# EAGLE design kfly_v3.1 (EAGLE 6.5.0)

## Sheet 1 of 8: MCU
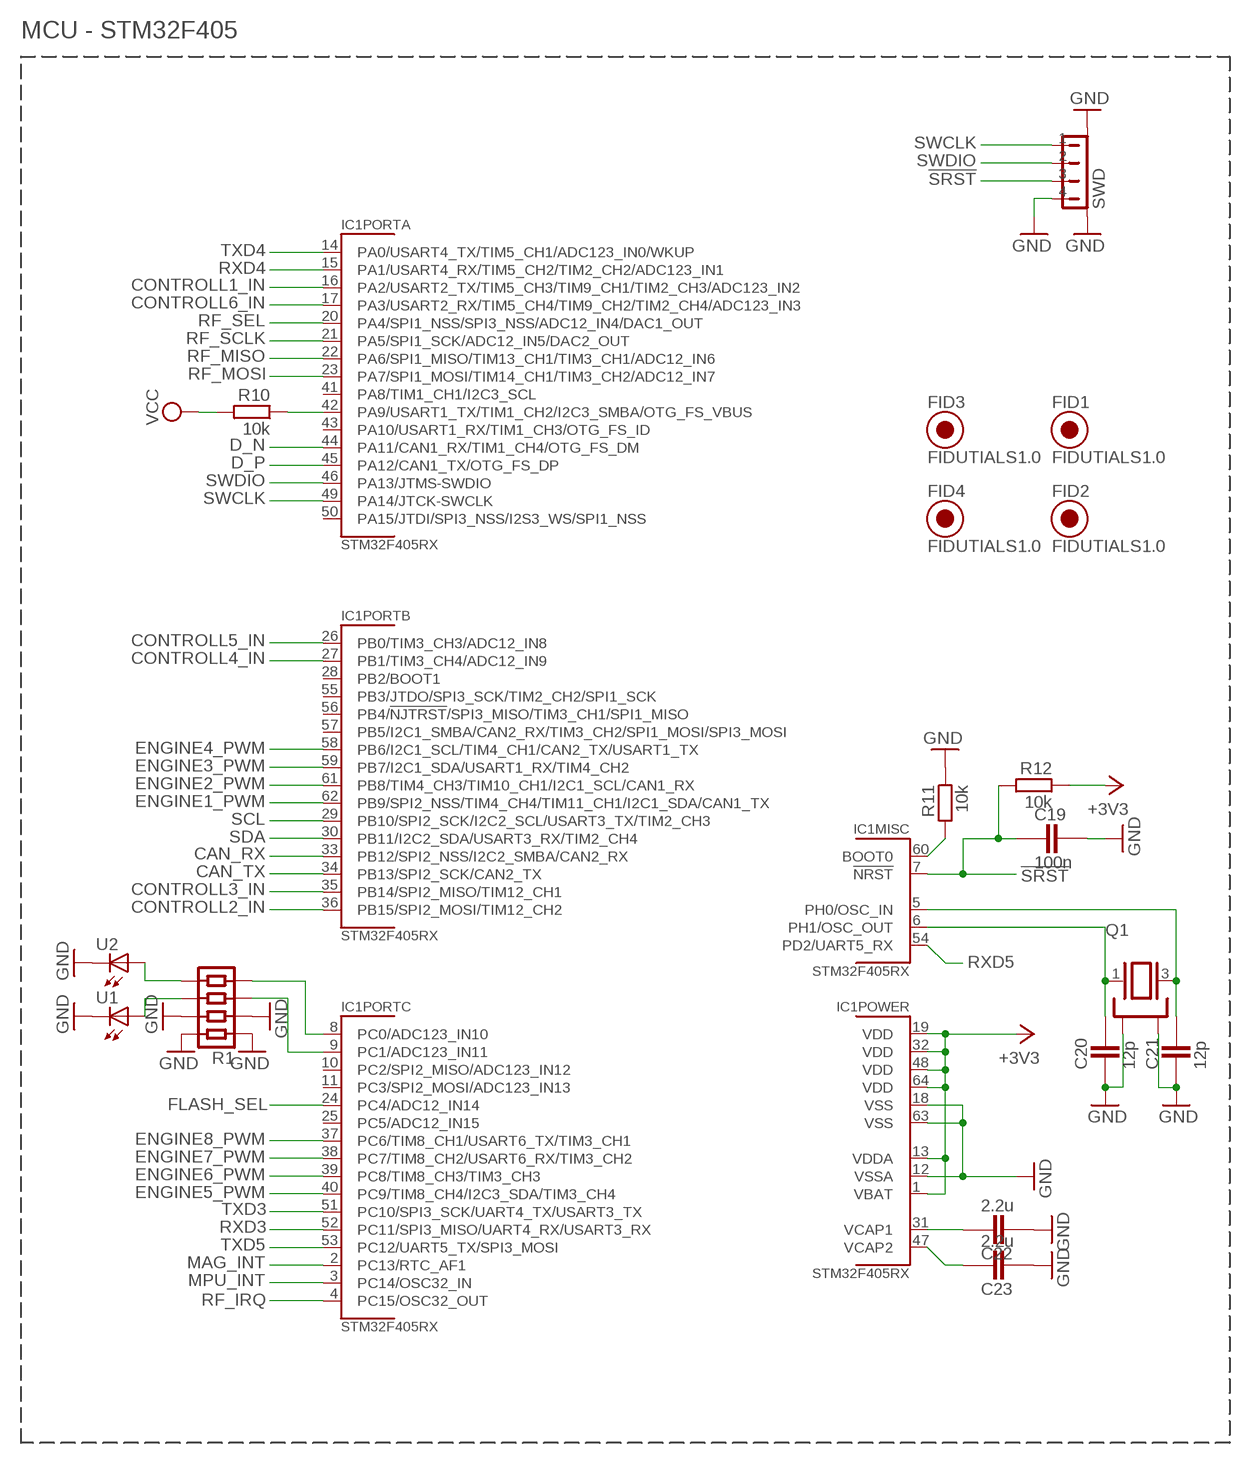
[diagram p0: schematic, sheet 1]

### Parts
C19  100n  CAPACITOR_0402  [CAPC1005X60N]
C20  12p  CAPACITOR_0402  [CAPC1005X60N]
C21  12p  CAPACITOR_0402  [CAPC1005X60N]
C22  2.2u  CAPACITOR_0603  [CAPC1608X92N]
C23  2.2u  CAPACITOR_0603  [CAPC1608X92N]
FID1  FIDUTIALS1.0  [FID1.0]
FID2  FIDUTIALS1.0  [FID1.0]
FID3  FIDUTIALS1.0  [FID1.0]
FID4  FIDUTIALS1.0  [FID1.0]
IC1  STM32F405RX  STM32F4X5RX  [LQFP64-10X10]
Q1  2.5X3.2CRYSTAL  [2.5X3.2CRYSTAL]
R1  RESISTOR-4ARRAY-0804  [RESISTORARRAY_0804]
R10  10k  RESISTOR_0402  [RESC1005X40AN]
R11  10k  RESISTOR_0402  [RESC1005X40AN]
R12  10k  RESISTOR_0402  [RESC1005X40AN]
SWD  JST-4PIN-SIDE-1.0  [JST-4PIN-SIDE]
U1  LED0603  [LED-0603]
U2  LED0603  [LED-0603]

### Nets
!SRST: C19.1 IC1.7(MISC:!NRST!) R12.2 SWD.3
+3V3: IC1.1(POWER:VBAT) IC1.13(POWER:VDDA) IC1.19(POWER:VDD) IC1.32(POWER:VDD) IC1.48(POWER:VDD) IC1.64(POWER:VDD) R12.1 ; also sheet 2,3,4,6,8
CAN_RX: IC1.33(PORTB:PB12/SPI2_NSS/I2C2_SMBA/CAN2_RX) ; also sheet 6
CAN_TX: IC1.34(PORTB:PB13/SPI2_SCK/CAN2_TX) ; also sheet 6
CONTROLL1_IN: IC1.16(PORTA:PA2/USART2_TX/TIM5_CH3/TIM9_CH1/TIM2_CH3/ADC123_IN2) ; also sheet 6
CONTROLL2_IN: IC1.36(PORTB:PB15/SPI2_MOSI/TIM12_CH2) ; also sheet 6
CONTROLL3_IN: IC1.35(PORTB:PB14/SPI2_MISO/TIM12_CH1) ; also sheet 6
CONTROLL4_IN: IC1.27(PORTB:PB1/TIM3_CH4/ADC12_IN9) ; also sheet 6
CONTROLL5_IN: IC1.26(PORTB:PB0/TIM3_CH3/ADC12_IN8) ; also sheet 6
CONTROLL6_IN: IC1.17(PORTA:PA3/USART2_RX/TIM5_CH4/TIM9_CH2/TIM2_CH4/ADC123_IN3) ; also sheet 6
D_N: IC1.44(PORTA:PA11/CAN1_RX/TIM1_CH4/OTG_FS_DM) ; also sheet 5
D_P: IC1.45(PORTA:PA12/CAN1_TX/OTG_FS_DP) ; also sheet 5
ENGINE1_PWM: IC1.62(PORTB:PB9/SPI2_NSS/TIM4_CH4/TIM11_CH1/I2C1_SDA/CAN1_TX) ; also sheet 7
ENGINE2_PWM: IC1.61(PORTB:PB8/TIM4_CH3/TIM10_CH1/I2C1_SCL/CAN1_RX) ; also sheet 7
ENGINE3_PWM: IC1.59(PORTB:PB7/I2C1_SDA/USART1_RX/TIM4_CH2) ; also sheet 7
ENGINE4_PWM: IC1.58(PORTB:PB6/I2C1_SCL/TIM4_CH1/CAN2_TX/USART1_TX) ; also sheet 7
ENGINE5_PWM: IC1.40(PORTC:PC9/TIM8_CH4/I2C3_SDA/TIM3_CH4) ; also sheet 7
ENGINE6_PWM: IC1.39(PORTC:PC8/TIM8_CH3/TIM3_CH3) ; also sheet 7
ENGINE7_PWM: IC1.38(PORTC:PC7/TIM8_CH2/USART6_RX/TIM3_CH2) ; also sheet 7
ENGINE8_PWM: IC1.37(PORTC:PC6/TIM8_CH1/USART6_TX/TIM3_CH1) ; also sheet 7
FLASH_SEL: IC1.24(PORTC:PC4/ADC12_IN14) ; also sheet 3
GND: C19.2 C20.1 C21.1 C22.2 C23.2 IC1.12(POWER:VSSA) IC1.18(POWER:VSS) IC1.63(POWER:VSS) Q1.2 Q1.4 R1.1 R1.2 R1.7 R1.8 R11.1 SWD.4 SWD.NC1(P1) SWD.NC2(P2) U1.C U2.C ; also sheet 2,3,4,5,6,7,8
MAG_INT: IC1.2(PORTC:PC13/RTC_AF1) ; also sheet 4
MPU_INT: IC1.3(PORTC:PC14/OSC32_IN) ; also sheet 4
N$11: R1.5 U2.A
N$18: R1.6 U1.A
N$19: IC1.60(MISC:BOOT0) R11.2
N$20: IC1.8(PORTC:PC0/ADC123_IN10) R1.4
N$24: IC1.9(PORTC:PC1/ADC123_IN11) R1.3
N$25: C20.2 IC1.6(MISC:PH1/OSC_OUT) Q1.1
N$26: C21.2 IC1.5(MISC:PH0/OSC_IN) Q1.3
N$35: IC1.42(PORTA:PA9/USART1_TX/TIM1_CH2/I2C3_SMBA/OTG_FS_VBUS) R10.1
N$44: C22.1 IC1.31(POWER:VCAP1)
N$50: C23.1 IC1.47(POWER:VCAP2)
RF_IRQ: IC1.4(PORTC:PC15/OSC32_OUT) ; also sheet 8
RF_MISO: IC1.22(PORTA:PA6/SPI1_MISO/TIM13_CH1/TIM3_CH1/ADC12_IN6) ; also sheet 3,8
RF_MOSI: IC1.23(PORTA:PA7/SPI1_MOSI/TIM14_CH1/TIM3_CH2/ADC12_IN7) ; also sheet 3,8
RF_SCLK: IC1.21(PORTA:PA5/SPI1_SCK/ADC12_IN5/DAC2_OUT) ; also sheet 3,8
RF_SEL: IC1.20(PORTA:PA4/SPI1_NSS/SPI3_NSS/ADC12_IN4/DAC1_OUT) ; also sheet 8
RXD3: IC1.52(PORTC:PC11/SPI3_MISO/UART4_RX/USART3_RX) ; also sheet 6
RXD4: IC1.15(PORTA:PA1/USART4_RX/TIM5_CH2/TIM2_CH2/ADC123_IN1) ; also sheet 6
RXD5: IC1.54(MISC:PD2/UART5_RX) ; also sheet 6
SCL: IC1.29(PORTB:PB10/SPI2_SCK/I2C2_SCL/USART3_TX/TIM2_CH3) ; also sheet 4
SDA: IC1.30(PORTB:PB11/I2C2_SDA/USART3_RX/TIM2_CH4) ; also sheet 4
SWCLK: IC1.49(PORTA:PA14/JTCK-SWCLK) SWD.1
SWDIO: IC1.46(PORTA:PA13/JTMS-SWDIO) SWD.2
TXD3: IC1.51(PORTC:PC10/SPI3_SCK/UART4_TX/USART3_TX) ; also sheet 6
TXD4: IC1.14(PORTA:PA0/USART4_TX/TIM5_CH1/ADC123_IN0/WKUP) ; also sheet 6
TXD5: IC1.53(PORTC:PC12/UART5_TX/SPI3_MOSI) ; also sheet 6
VCC: R10.2 ; also sheet 2,5
Unconnected: IC1.10(PORTC:PC2/SPI2_MISO/ADC123_IN12) IC1.11(PORTC:PC3/SPI2_MOSI/ADC123_IN13) IC1.25(PORTC:PC5/ADC12_IN15) IC1.28(PORTB:PB2/BOOT1) IC1.41(PORTA:PA8/TIM1_CH1/I2C3_SCL) IC1.43(PORTA:PA10/USART1_RX/TIM1_CH3/OTG_FS_ID) IC1.50(PORTA:PA15/JTDI/SPI3_NSS/I2S3_WS/SPI1_NSS) IC1.55(PORTB:PB3/JTDO/SPI3_SCK/TIM2_CH2/SPI1_SCK) IC1.56(PORTB:PB4/!NJTRST!/SPI3_MISO/TIM3_CH1/SPI1_MISO) IC1.57(PORTB:PB5/I2C1_SMBA/CAN2_RX/TIM3_CH2/SPI1_MOSI/SPI3_MOSI)

### Notes on the sheet
- MCU - STM32F405

## Sheet 2 of 8: Power supply
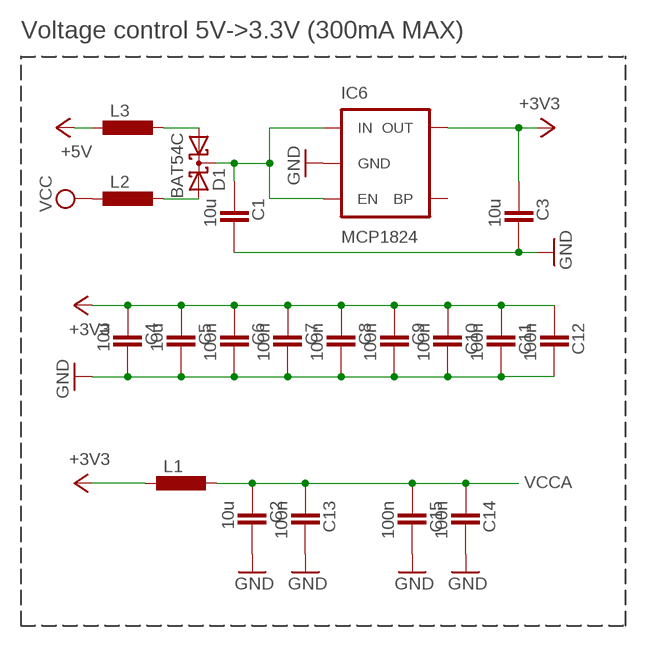
[diagram p1: schematic, sheet 2]

### Parts
C1  10u  CAPACITOR_0603  [CAPC1608X92N]
C2  10u  CAPACITOR_0603  [CAPC1608X92N]
C3  10u  CAPACITOR_0603  [CAPC1608X92N]
C4  10u  CAPACITOR_0603  [CAPC1608X92N]
C5  10u  CAPACITOR_0603  [CAPC1608X92N]
C6  100n  CAPACITOR_0402  [CAPC1005X60N]
C7  100n  CAPACITOR_0402  [CAPC1005X60N]
C8  100n  CAPACITOR_0402  [CAPC1005X60N]
C9  100n  CAPACITOR_0402  [CAPC1005X60N]
C10  100n  CAPACITOR_0402  [CAPC1005X60N]
C11  100n  CAPACITOR_0402  [CAPC1005X60N]
C12  100n  CAPACITOR_0402  [CAPC1005X60N]
C13  100n  CAPACITOR_0402  [CAPC1005X60N]
C14  100n  CAPACITOR_0402  [CAPC1005X60N]
C15  100n  CAPACITOR_0402  [CAPC1005X60N]
D1  BAT54C  [SOT23]
IC6  MCP1824  V_REG_LDOSMD  [SOT23-5]
L1  INDUCTOR_0603  [INDC1608X95N]
L2  INDUCTOR_0603  [INDC1608X95N]
L3  INDUCTOR_0603  [INDC1608X95N]

### Nets
+3V3: C3.1 C4.1 C5.1 C6.1 C7.1 C8.1 C9.1 C10.1 C11.1 C12.1 IC6.5(OUT) L1.1 ; also sheet 1,3,4,6,8
+5V: L3.1 ; also sheet 6,7
GND: C1.2 C2.2 C3.2 C4.2 C5.2 C6.2 C7.2 C8.2 C9.2 C10.2 C11.2 C12.2 C13.2 C14.2 C15.2 IC6.2(GND) ; also sheet 1,3,4,5,6,7,8
N$21: D1.2(A2) L2.2
N$45: D1.1(A1) L3.2
V_RC: C1.1 D1.3(CC) IC6.1(IN) IC6.3(EN)
VCC: L2.1 ; also sheet 1,5
VCCA: C2.1 C13.1 C14.1 C15.1 L1.2 ; also sheet 4
Unconnected: IC6.4(BP)

### Notes on the sheet
- Voltage control 5V->3.3V (300mA MAX)

## Sheet 3 of 8: Flash Memory
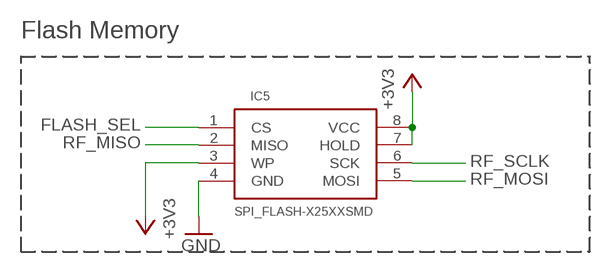
[diagram p2: schematic, sheet 3]

### Parts
IC5  SPI_FLASH-X25XXSMD  [SO08]

### Nets
+3V3: IC5.3(WP) IC5.7(HOLD) IC5.8(VCC) ; also sheet 1,2,4,6,8
FLASH_SEL: IC5.1(CS) ; also sheet 1
GND: IC5.4(GND) ; also sheet 1,2,4,5,6,7,8
RF_MISO: IC5.2(MISO) ; also sheet 1,8
RF_MOSI: IC5.5(MOSI) ; also sheet 1,8
RF_SCLK: IC5.6(SCK) ; also sheet 1,8

### Notes on the sheet
- Flash Memory

## Sheet 4 of 8: Sensors and their power suppy
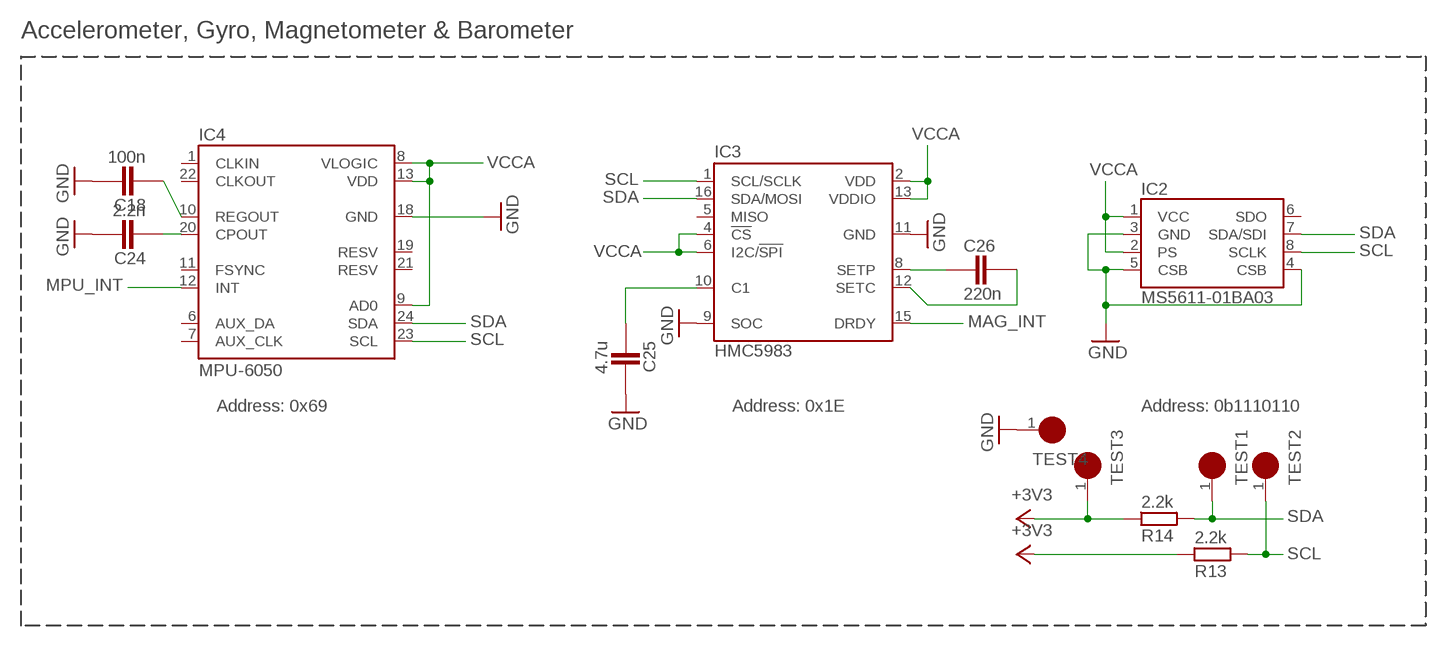
[diagram p3: schematic, sheet 4]

### Parts
C18  100n  CAPACITOR_0402  [CAPC1005X60N]
C24  2.2n  CAPACITOR_0402  [CAPC1005X60N]
C25  4.7u  CAPACITOR_0603  [CAPC1608X92N]
C26  220n  CAPACITOR_0603  [CAPC1608X92N]
IC2  MS5611-01BA03  MS5611-01BA01  [MS5611]
IC3  HMC5983  [LPCC16]
IC4  MPU-6050  [QFN-24]
R13  2.2k  RESISTOR_0402  [RESC1005X40AN]
R14  2.2k  RESISTOR_0402  [RESC1005X40AN]
TEST1  TESTPOINT  [TESTPOINT_1.2]
TEST2  TESTPOINT  [TESTPOINT_1.2]
TEST3  TESTPOINT  [TESTPOINT_1.2]
TEST4  TESTPOINT  [TESTPOINT_1.2]

### Nets
+3V3: R13.1 R14.1 TEST3.1 ; also sheet 1,2,3,6,8
GND: C18.2 C24.2 C25.2 IC2.3(GND) IC2.4(CSB) IC2.5(CSB) IC3.9(SOC) IC3.11(GND) IC4.18(GND) TEST4.1 ; also sheet 1,2,3,5,6,7,8
MAG_INT: IC3.15(DRDY) ; also sheet 1
MPU_INT: IC4.12(INT) ; also sheet 1
N$1: C25.1 IC3.10(C1)
N$8: C26.1 IC3.8(SETP)
N$10: C26.2 IC3.12(SETC)
N$13: C18.1 IC4.10(REGOUT)
N$14: C24.1 IC4.20(CPOUT)
SCL: IC2.8(SCLK) IC3.1(SCL/SCLK) IC4.23(SCL) R13.2 TEST2.1 ; also sheet 1
SDA: IC2.7(SDA/SDI) IC3.16(SDA/MOSI) IC4.24(SDA) R14.2 TEST1.1 ; also sheet 1
VCCA: IC2.1(VCC) IC2.2(PS) IC3.2(VDD) IC3.4(!CS) IC3.6(I2C/!SPI) IC3.13(VDDIO) IC4.8(VLOGIC) IC4.9(AD0) IC4.13(VDD) ; also sheet 2
Unconnected: IC2.6(SDO) IC3.5(MISO) IC4.1(CLKIN) IC4.6(AUX_DA) IC4.7(AUX_CLK) IC4.11(FSYNC) IC4.19(RESV) IC4.21(RESV) IC4.22(CLKOUT)

### Notes on the sheet
- Accelerometer, Gyro, Magnetometer & Barometer
- Address: 0x69 | Address: 0x1E | Address: 0b1110110

## Sheet 5 of 8: USB
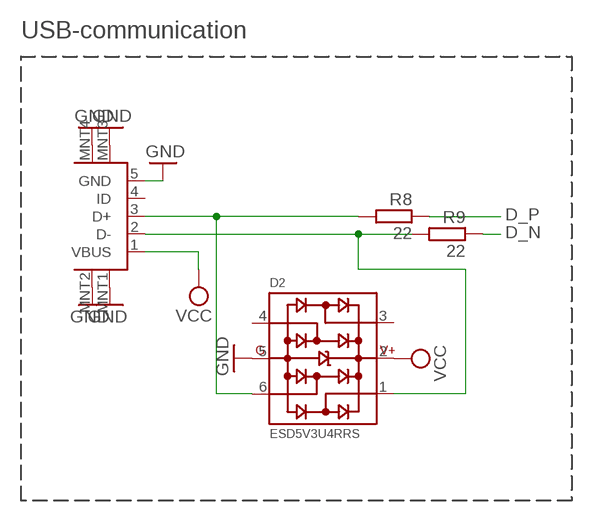
[diagram p4: schematic, sheet 5]

### Parts
D2  ESD5V3U4RRS  [SOT363]
R8  22  RESISTOR_0402  [RESC1005X40AN]
R9  22  RESISTOR_0402  [RESC1005X40AN]
USB1  USB-MICRO-B-BOTTOM  [MICROUSB_TYPEB_SURFACE]

### Nets
D_N: R9.1 ; also sheet 1
D_P: R8.1 ; also sheet 1
GND: D2.5 USB1.5(GND) USB1.MNT1(MTN1) USB1.MNT2(MTN2) USB1.MNT3(MTN3) USB1.MNT4(MTN4) ; also sheet 1,2,3,4,6,7,8
N$2: D2.6 R8.2 USB1.3(D+)
N$7: D2.1 R9.2 USB1.2(D-)
VCC: D2.2 USB1.1(VBUS) ; also sheet 1,2
Unconnected: D2.3 D2.4 USB1.4(ID)

### Notes on the sheet
- USB-communication

## Sheet 6 of 8: Communication Input and Outputs
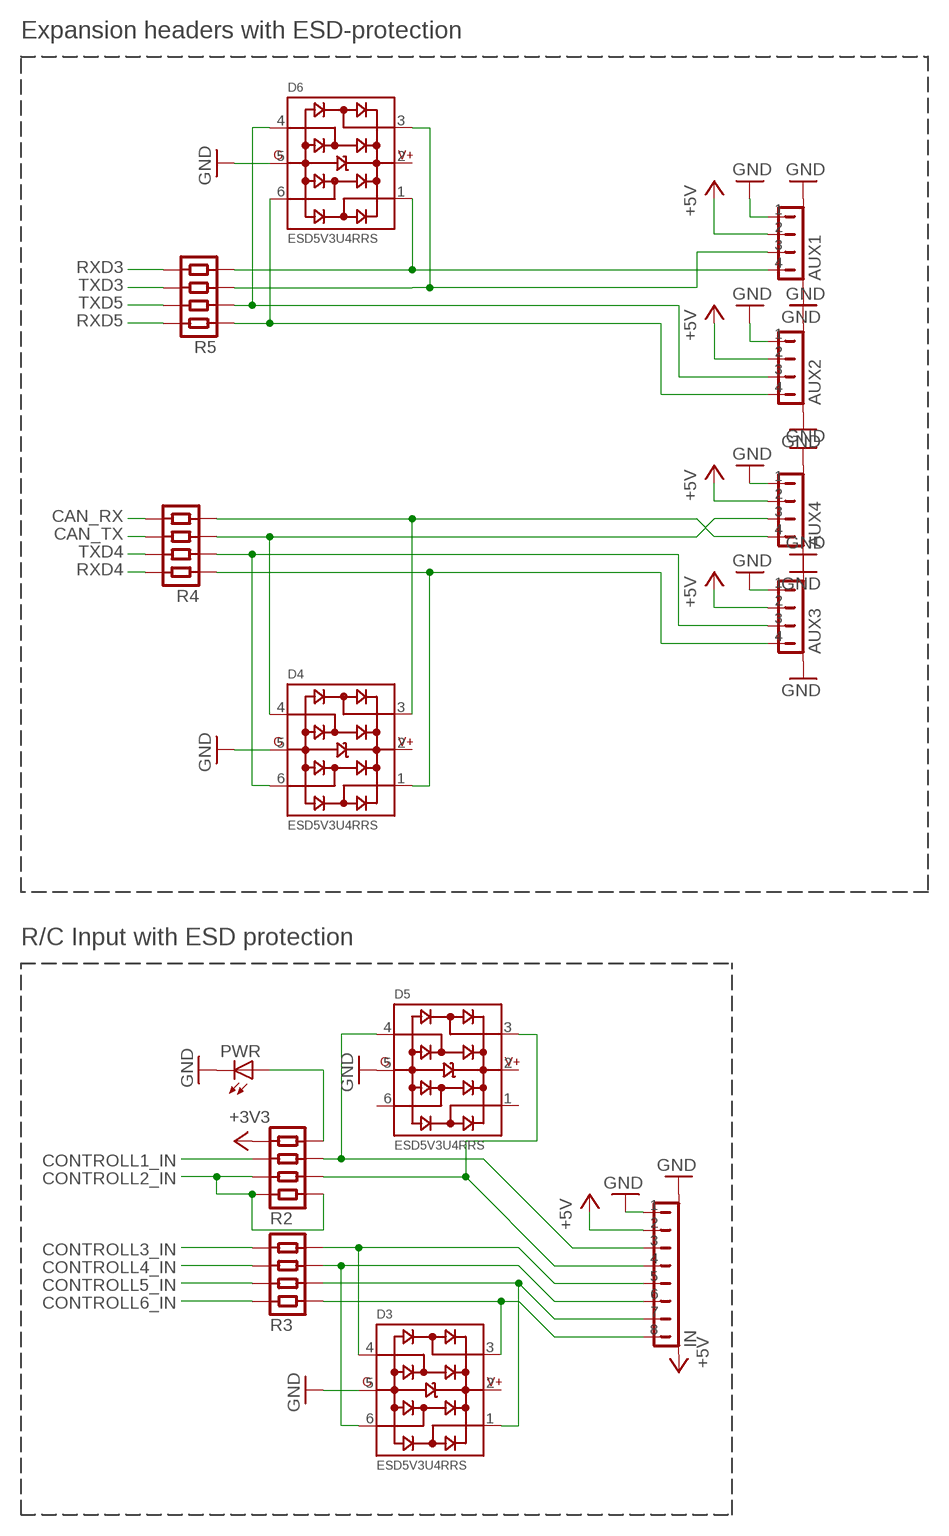
[diagram p5: schematic, sheet 6]

### Parts
AUX1  JST-4PIN-SIDE-1.0  [JST-4PIN-SIDE]
AUX2  JST-4PIN-SIDE-1.0  [JST-4PIN-SIDE]
AUX3  JST-4PIN-SIDE-1.0  [JST-4PIN-SIDE]
AUX4  JST-4PIN-SIDE-1.0  [JST-4PIN-SIDE]
D3  ESD5V3U4RRS  [SOT363]
D4  ESD5V3U4RRS  [SOT363]
D5  ESD5V3U4RRS  [SOT363]
D6  ESD5V3U4RRS  [SOT363]
IN  JST-8PIN-SIDE-1.0  [JST-8PIN-SIDE]
PWR  LED0603  [LED-0603]
R2  RESISTOR-4ARRAY-0804  [RESISTORARRAY_0804]
R3  RESISTOR-4ARRAY-0804  [RESISTORARRAY_0804]
R4  RESISTOR-4ARRAY-0804  [RESISTORARRAY_0804]
R5  RESISTOR-4ARRAY-0804  [RESISTORARRAY_0804]

### Nets
+3V3: R2.4 ; also sheet 1,2,3,4,8
+5V: AUX1.2 AUX2.2 AUX3.2 AUX4.2 IN.2 IN.NC2(GND2) ; also sheet 2,7
CAN_RX: R4.5 ; also sheet 1
CAN_TX: R4.6 ; also sheet 1
CONTROLL1_IN: R2.3 ; also sheet 1
CONTROLL2_IN: R2.1 R2.2 R2.8 ; also sheet 1
CONTROLL3_IN: R3.4 ; also sheet 1
CONTROLL4_IN: R3.3 ; also sheet 1
CONTROLL5_IN: R3.2 ; also sheet 1
CONTROLL6_IN: R3.1 ; also sheet 1
GND: AUX1.1 AUX1.NC1(P1) AUX1.NC2(P2) AUX2.1 AUX2.NC1(P1) AUX2.NC2(P2) AUX3.1 AUX3.NC1(P1) AUX3.NC2(P2) AUX4.1 AUX4.NC1(P1) AUX4.NC2(P2) D3.5 D4.5 D5.5 D6.5 IN.1 IN.NC1(GND1) PWR.C ; also sheet 1,2,3,4,5,7,8
N$6: AUX2.3 D6.4 R5.2
N$9: PWR.A R2.5
N$15: AUX3.3 D4.6 R4.2
N$23: D5.4 IN.3 R2.6
N$27: D3.3 IN.8 R3.8
N$28: D3.4 IN.5 R3.5
N$30: AUX4.4 D4.3 R4.4
N$31: AUX4.3 D4.4 R4.3
N$32: AUX3.4 D4.1 R4.1
N$33: D3.1 IN.7 R3.7
N$34: D3.6 IN.6 R3.6
N$38: AUX1.3 D6.3 R5.3
N$40: AUX2.4 D6.6 R5.1
N$46: D5.3 IN.4 R2.7
N$51: AUX1.4 D6.1 R5.4
RXD3: R5.5 ; also sheet 1
RXD4: R4.8 ; also sheet 1
RXD5: R5.8 ; also sheet 1
TXD3: R5.6 ; also sheet 1
TXD4: R4.7 ; also sheet 1
TXD5: R5.7 ; also sheet 1
Unconnected: D3.2 D4.2 D5.1 D5.2 D5.6 D6.2

### Notes on the sheet
- Expansion headers with ESD-protection
- R/C Input with ESD protection

## Sheet 7 of 8: PPM out
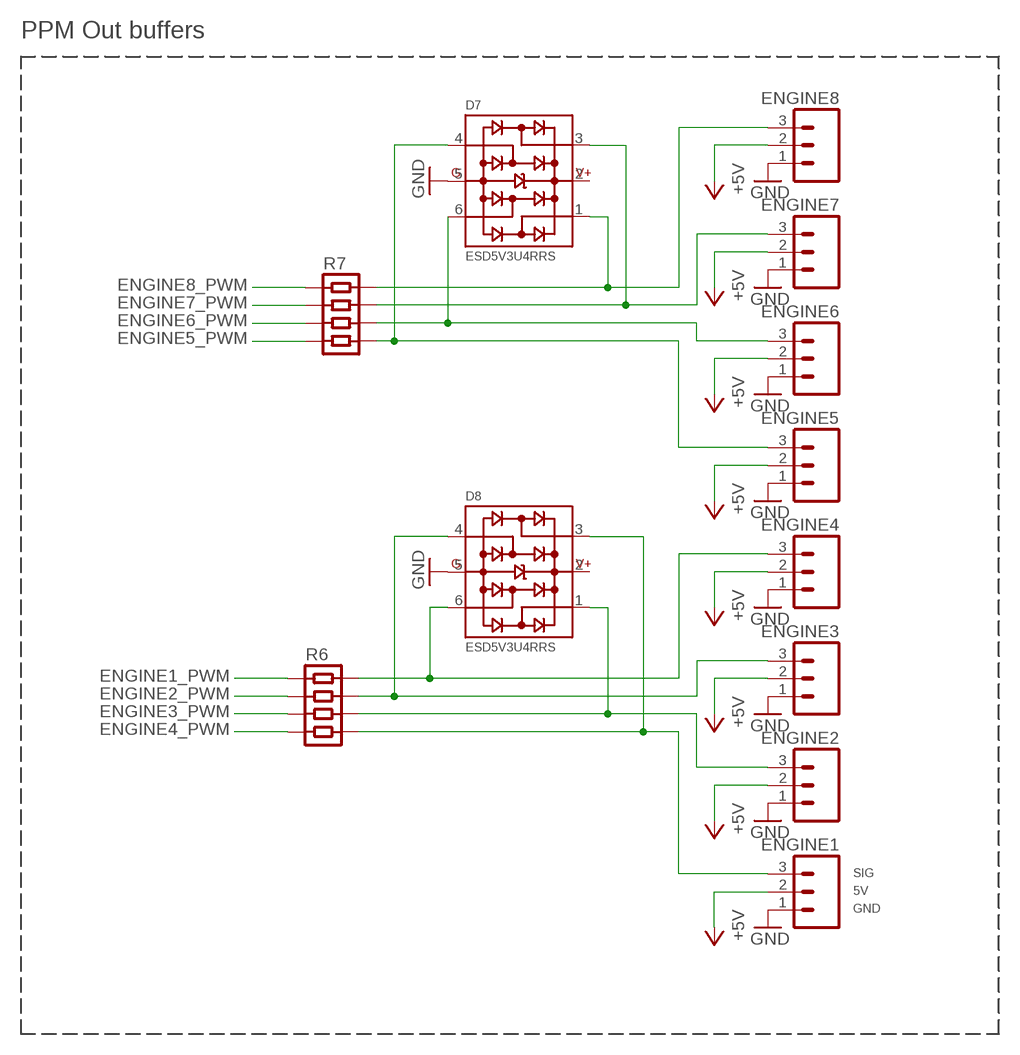
[diagram p6: schematic, sheet 7]

### Parts
D7  ESD5V3U4RRS  [SOT363]
D8  ESD5V3U4RRS  [SOT363]
ENGINE1  M03TH_90DEG  [M03_90DEG]
ENGINE2  M03TH_90DEG  [M03_90DEG]
ENGINE3  M03TH_90DEG  [M03_90DEG]
ENGINE4  M03TH_90DEG  [M03_90DEG]
ENGINE5  M03TH_90DEG  [M03_90DEG]
ENGINE6  M03TH_90DEG  [M03_90DEG]
ENGINE7  M03TH_90DEG  [M03_90DEG]
ENGINE8  M03TH_90DEG  [M03_90DEG]
R6  RESISTOR-4ARRAY-0804  [RESISTORARRAY_0804]
R7  RESISTOR-4ARRAY-0804  [RESISTORARRAY_0804]

### Nets
+5V: ENGINE1.2 ENGINE2.2 ENGINE3.2 ENGINE4.2 ENGINE5.2 ENGINE6.2 ENGINE7.2 ENGINE8.2 ; also sheet 2,6
ENGINE1_PWM: R6.1 ; also sheet 1
ENGINE2_PWM: R6.2 ; also sheet 1
ENGINE3_PWM: R6.3 ; also sheet 1
ENGINE4_PWM: R6.4 ; also sheet 1
ENGINE5_PWM: R7.4 ; also sheet 1
ENGINE6_PWM: R7.3 ; also sheet 1
ENGINE7_PWM: R7.2 ; also sheet 1
ENGINE8_PWM: R7.1 ; also sheet 1
GND: D7.5 D8.5 ENGINE1.1 ENGINE2.1 ENGINE3.1 ENGINE4.1 ENGINE5.1 ENGINE6.1 ENGINE7.1 ENGINE8.1 ; also sheet 1,2,3,4,5,6,8
N$3: D7.1 ENGINE8.3 R7.8
N$4: D7.3 ENGINE7.3 R7.7
N$5: D7.6 ENGINE6.3 R7.6
N$12: D7.4 ENGINE5.3 R7.5
N$16: D8.1 ENGINE2.3 R6.6
N$17: D8.3 ENGINE1.3 R6.5
N$22: D8.6 ENGINE4.3 R6.8
N$29: D8.4 ENGINE3.3 R6.7
Unconnected: D7.2 D8.2

### Notes on the sheet
- PPM Out buffers
- SIG
- 5V
- GND

## Sheet 8 of 8: RF
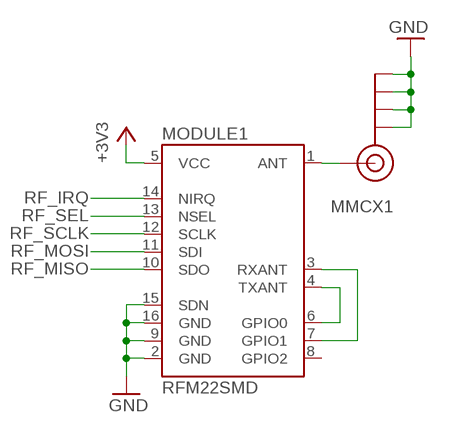
[diagram p7: schematic, sheet 8]

### Parts
MMCX1  MMCX  [MMCX_THROUGHHOLE_RIGHTANGLE]
MODULE1  RFM22SMD  [RFM22-XXX-S2]

### Nets
+3V3: MODULE1.5(VCC) ; also sheet 1,2,3,4,6
GND: MMCX1.G1(GND) MMCX1.G2(GND) MMCX1.G3(GND) MMCX1.G4(GND) MODULE1.2(GND) MODULE1.9(GND) MODULE1.15(SDN) MODULE1.16(GND) ; also sheet 1,2,3,4,5,6,7
N$56: MMCX1.S(SIGNAL) MODULE1.1(ANT)
N$67: MODULE1.4(TXANT) MODULE1.6(GPIO0)
N$68: MODULE1.3(RXANT) MODULE1.7(GPIO1)
RF_IRQ: MODULE1.14(NIRQ) ; also sheet 1
RF_MISO: MODULE1.10(SDO) ; also sheet 1,3
RF_MOSI: MODULE1.11(SDI) ; also sheet 1,3
RF_SCLK: MODULE1.12(SCLK) ; also sheet 1,3
RF_SEL: MODULE1.13(NSEL) ; also sheet 1
Unconnected: MODULE1.8(GPIO2)

## Library data of the parts
AUX1-AUX4 SWD = korken:JST-4PIN-SIDE-1.0
C1-C15 C18-C26 = ipc-7351-capacitor:CAPACITOR_
D1 = diode:BAT54C: Schottky Diodes Source: Fairchild .. BAT54.pdf
D2-D8 = korken:ESD5V3U4RRS
ENGINE1-ENGINE8 = korken:M03
FID1-FID4 = korken:FIDUTIALS
IC1 = korken:STM32F4X5RX
IC2 = korken:MS5611-01BA01
IC3 = korken:HMC5983
IC4 = korken:MPU-6050
IC5 = SparkFun:SPI_FLASH-X25XX: 8pin SPI Flash series x25xx. Works with devices like W25X32 and BR25L32
IC6 = SparkFun:V_REG_LDO: Voltage Regulator LDO Standard 150mA LDO voltage regulator in SOT-23 layout. Micrel part MIC5205. BP (by-pass) pin is used to lower output noise with 470pF cap.
IN = korken:JST-8PIN-SIDE-1.0
L1-L3 = ipc-7351-inductor:INDUCTOR_
MMCX1 = korken:MMCX
MODULE1 = SparkFun:RFM22: Description: The RFM22 is a low-power, low cost radio that is capable of operating in the 434MHz and 900MHz open bands. It's frequency is software defined and there are some very good libraries written for it.
PWR U1 U2 = SparkFun:LED: LEDs Standard schematic elements and footprints for 5mm, 3mm, 1206, and 0603 sized LEDs. 5mm - Spark Fun Electronics SKU : COM-00529 (and others)
Q1 = korken:2.5X3.2CRYSTAL
R1-R7 = korken:RESISTOR-4ARRAY-0804
R8-R14 = ipc-7351-resistor:RESISTOR_
TEST1-TEST4 = korken:TESTPOINT
USB1 = korken:USB-MICRO-B-BOTTOM

## Board
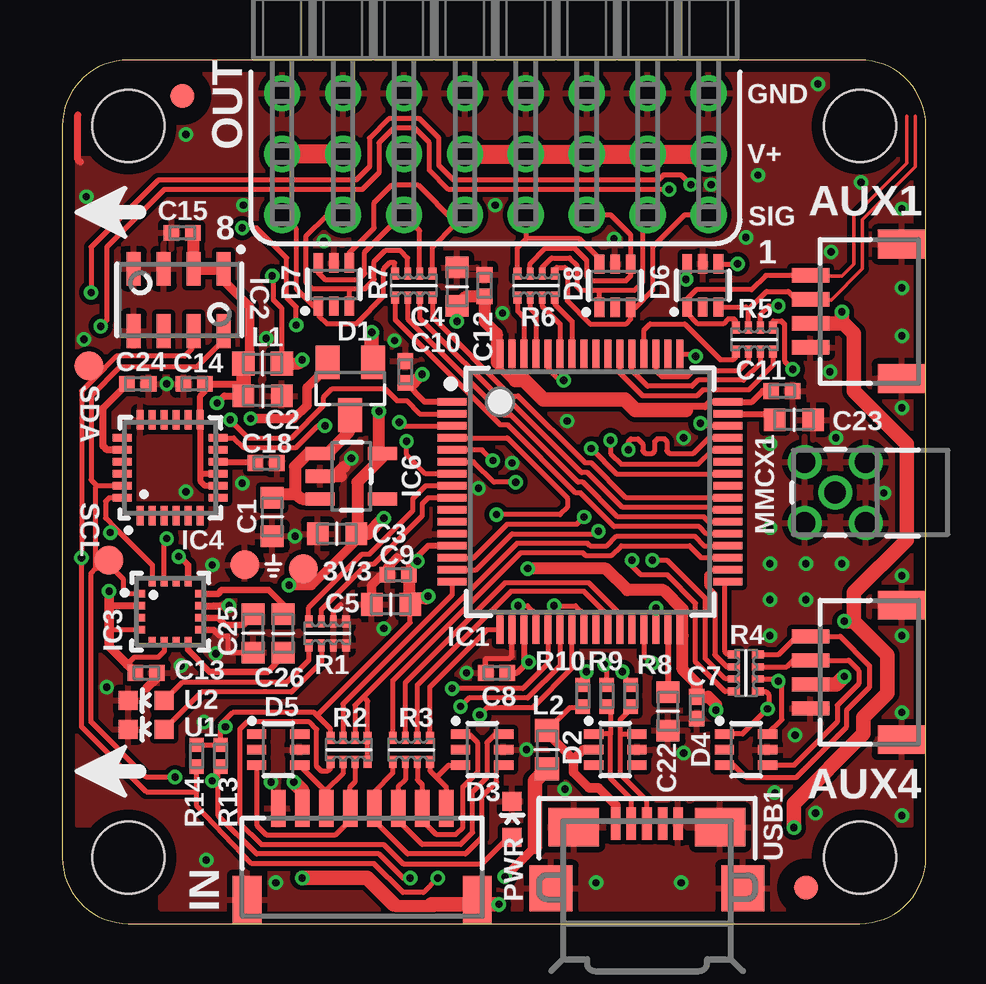
[diagram p8: board, top side]
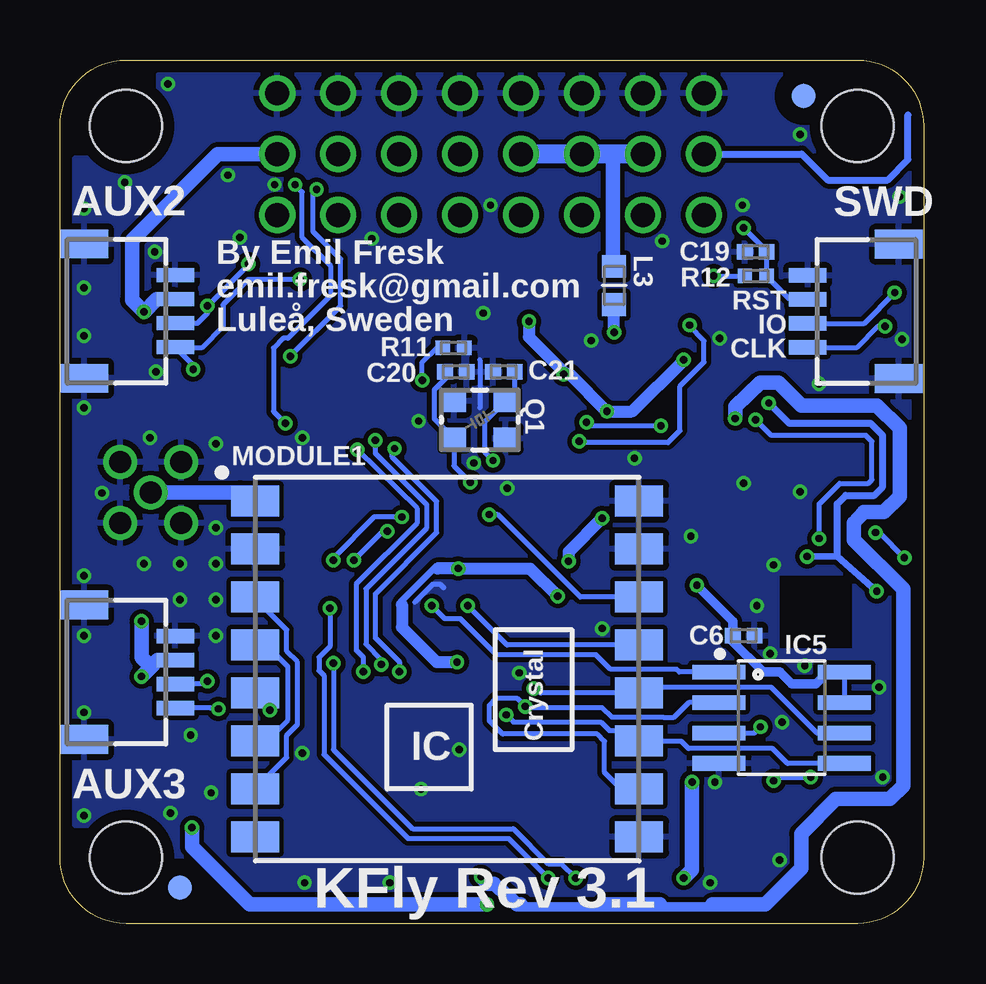
[diagram p9: board, bottom side, seen from below]

Size 36 x 36 mm. Coordinates in mm from the lower left corner, seen from the top.
Outline: 0,33.25 0,2.75 arc90 2.75,0 33.25,0 arc90 36,2.75 36,33.25 arc90 33.25,36 2.75,36 arc90 0,33.25
Copper layers (1*2*15*16): Top 0.035mm / dielectric 0.4mm / InnerTop 0.035mm / dielectric 0.4mm / InnerBottom 0.035mm / dielectric 0.4mm / Bottom 0.035mm
Design rules "korken_default *": minimum track width 0.15mm, minimum drill 0.3mm, track to track 0.15mm, track to pad 0.15mm, pad to pad 0.15mm, via to via 0.15mm, smd to smd 0mil, copper to edge 0.5mm, drill to drill 0.25mm, minimum pad ring 10mil, minimum via ring 0.15mm, stop-mask expansion 0.1mm, vias tented up to drill 0.4mm, thermal gap 0.25mm
Holes 3 mm at 2.75,2.75 33.25,2.75 33.25,33.25 2.75,33.25

### Footprints (pad centres in the part's own frame; a part is rotated, then mirrored left to right if it is on the bottom)
JST-4PIN-SIDE = smd 0.6 x 1.55: 1 1.48,-2.81; 2 0.48,-2.81; 3 -0.52,-2.81; 4 -1.52,-2.81 | smd 1.2 x 2: NC1 2.78,0.99; NC2 -2.82,0.99
CAPC1608X92N = smd 0.9 x 0.95: 1 -0.8,0; 2 0.8,0
CAPC1005X60N = smd 0.65 x 0.65: 1 -0.45,0; 2 0.45,0
SOT23 = smd 1 x 1.4: 1 -0.95,-1.1; 2 0.95,-1.1; 3 0,1.1
SOT363 = smd 0.4 x 0.8: 1 -0.65,-0.9; 2 0,-0.9; 3 0.65,-0.9; 4 0.65,0.9; 5 0,0.9; 6 -0.65,0.9
M03_90DEG = drill 1: 1 -2.54,0; 2 0,0; 3 2.54,0
FID1.0 = smd 1 x 1: P$1 0,0
LQFP64-10X10 = smd 0.3 x 1.2: 1 -3.75,-5.75; 2 -3.25,-5.75; 3 -2.75,-5.75; 4 -2.25,-5.75; 5 -1.75,-5.75; 6 -1.25,-5.75; 7 -0.75,-5.75; 8 -0.25,-5.75; 9 0.25,-5.75; 10 0.75,-5.75; 11 1.25,-5.75; 12 1.75,-5.75; 13 2.25,-5.75; 14 2.75,-5.75; 15 3.25,-5.75; 16 3.75,-5.75; 33 3.75,5.75; 34 3.25,5.75; 35 2.75,5.75; 36 2.25,5.75; 37 1.75,5.75; 38 1.25,5.75; 39 0.75,5.75; 40 0.25,5.75; 41 -0.25,5.75; 42 -0.75,5.75; 43 -1.25,5.75; 44 -1.75,5.75; 45 -2.25,5.75; 46 -2.75,5.75; 47 -3.25,5.75; 48 -3.75,5.75 | smd 1.2 x 0.3: 17 5.75,-3.75; 18 5.75,-3.25; 19 5.75,-2.75; 20 5.75,-2.25; 21 5.75,-1.75; 22 5.75,-1.25; 23 5.75,-0.75; 24 5.75,-0.25; 25 5.75,0.25; 26 5.75,0.75; 27 5.75,1.25; 28 5.75,1.75; 29 5.75,2.25; 30 5.75,2.75; 31 5.75,3.25; 32 5.75,3.75; 49 -5.75,3.75; 50 -5.75,3.25; 51 -5.75,2.75; 52 -5.75,2.25; 53 -5.75,1.75; 54 -5.75,1.25; 55 -5.75,0.75; 56 -5.75,0.25; 57 -5.75,-0.25; 58 -5.75,-0.75; 59 -5.75,-1.25; 60 -5.75,-1.75; 61 -5.75,-2.25; 62 -5.75,-2.75; 63 -5.75,-3.25; 64 -5.75,-3.75
MS5611 = smd 1.4 x 0.6: 1 -1.3,1.875; 2 -1.3,0.625; 3 -1.3,-0.625; 4 -1.3,-1.875; 5 1.3,-1.875; 6 1.3,-0.625; 7 1.3,0.625; 8 1.3,1.875
LPCC16 = smd 0.45 x 0.3: 1 -1.27,0.75; 2 -1.27,0.25; 3 -1.27,-0.25; 4 -1.27,-0.75; 9 1.27,-0.75; 10 1.27,-0.25; 11 1.27,0.25; 12 1.27,0.75 | smd 0.3 x 0.45: 5 -0.75,-1.27; 6 -0.25,-1.27; 7 0.25,-1.27; 8 0.75,-1.27; 13 0.75,1.27; 14 0.25,1.27; 15 -0.25,1.27; 16 -0.75,1.27
QFN-24 = smd 0.8 x 0.3: 1 -2,1.25; 2 -2,0.75; 3 -2,0.25; 4 -2,-0.25; 5 -2,-0.75; 6 -2,-1.25; 13 2,-1.25; 14 2,-0.75; 15 2,-0.25; 16 2,0.25; 17 2,0.75; 18 2,1.25 | smd 0.3 x 0.8: 7 -1.25,-2; 8 -0.75,-2; 9 -0.25,-2; 10 0.25,-2; 11 0.75,-2; 12 1.25,-2; 19 1.25,2; 20 0.75,2; 21 0.25,2; 22 -0.25,2; 23 -0.75,2; 24 -1.25,2
SO08 = smd 0.61 x 2.21: 1 -1.905,-2.616; 2 -0.635,-2.616; 3 0.635,-2.616; 4 1.905,-2.616; 5 1.905,2.616; 6 0.635,2.616; 7 -0.635,2.616; 8 -1.905,2.616
SOT23-5 = smd 0.55 x 1.2: 1 -0.95,-1.3; 2 0,-1.3; 3 0.95,-1.3; 4 0.95,1.3; 5 -0.95,1.3
JST-8PIN-SIDE = smd 0.6 x 1.55: 1 3.5,-2.8; 2 2.5,-2.8; 3 1.5,-2.8; 4 0.5,-2.8; 5 -0.5,-2.8; 6 -1.5,-2.8; 7 -2.5,-2.8; 8 -3.5,-2.8 | smd 1.2 x 2: NC1 4.8,1; NC2 -4.8,1
INDC1608X95N = smd 0.95 x 1: 1 -0.8,0; 2 0.8,0
MMCX_THROUGHHOLE_RIGHTANGLE = drill 0.9: G1 -1.27,1.27; G2 1.27,1.27; G3 1.27,-1.27; G4 -1.27,-1.27; S 0,0
RFM22-XXX-S2 = smd 2 x 1.3: 1 -8,7; 2 -8,5; 3 -8,3; 4 -8,1; 5 -8,-1; 6 -8,-3; 7 -8,-5; 8 -8,-7; 9 8,-7; 10 8,-5; 11 8,-3; 12 8,-1; 13 8,1; 14 8,3; 15 8,5; 16 8,7
LED-0603 = smd 0.8 x 0.8: A 0,-0.75; C 0,0.75
2.5X3.2CRYSTAL = smd 1 x 0.9: 1 -1.075,-0.775; 2 1.075,-0.775; 3 1.075,0.775; 4 -1.075,0.775
RESISTORARRAY_0804 = smd 0.33 x 0.5: 1 -0.775,-0.5; 4 0.775,-0.5; 5 0.775,0.5; 8 -0.775,0.5 | smd 0.28 x 0.5: 2 -0.25,-0.5; 3 0.25,-0.5; 6 0.25,0.5; 7 -0.25,0.5
RESC1005X40AN = smd 0.6 x 0.6: 1 -0.45,0; 2 0.45,0
TESTPOINT_1.2 = smd 1.2 x 1.2: 1 0,0
MICROUSB_TYPEB_SURFACE = smd 0.4 x 1.35: 1 -1.3,2.65; 2 -0.65,2.65; 3 0,2.65; 4 0.65,2.65; 5 1.3,2.65 | smd 1.8 x 1.9: MNT1 -4,-0.05; MNT2 4,-0.05 | smd 2.1 x 1.6: MNT3 3.05,2.5; MNT4 -3.05,2.5

### Placement (x,y rotation side)
AUX1  34,25.5 270 top
AUX2  34,25.55 90 bottom
AUX3  34,10.5 90 bottom
AUX4  34,10.45 270 top
C1  8.75,16.95 270 top
C2  8.35,22 0 top
C3  11.45,16.25 180 top
C4  16.45,26.55 90 top
C5  13.7,13.3 180 top
C6  7.5,12 0 bottom
C7  26.45,9 270 top
C8  18.1,10.45 180 top
C9  14,14.55 180 top
C10  14.3,23 90 top
C11  30,22.2 0 top
C12  17.6,26.6 90 top
C13  3.5,10.45 0 top
C14  5.5,22.5 180 top
C15  5,28.8 180 top
C18  8.5,19.2 0 top
C19  7,28 180 bottom
C20  19.5,23 180 bottom
C21  17.5,23 0 bottom
C22  25.25,8.85 270 top
C23  30.5,21 0 top
C24  3.15,22.5 0 top
C25  7.95,12.1 270 top
C26  9.2,12.1 90 top
D1  12,22.3 180 top
D2  23.05,7.25 270 top
D3  17.5,7.25 270 top
D4  28.5,7.25 270 top
D5  9,7.25 270 top
D6  26.7,26.6 0 top
D7  11.32,26.64 0 top
D8  23.04,26.59 0 top
ENGINE1  26.94,32.08 270 top
ENGINE2  24.4,32.08 270 top
ENGINE3  21.86,32.08 270 top
ENGINE4  19.32,32.08 270 top
ENGINE5  16.78,32.08 270 top
ENGINE6  14.24,32.08 270 top
ENGINE7  11.7,32.08 270 top
ENGINE8  9.16,32.08 270 top
FID1  31,1.5 0 top
FID2  5,34.5 0 top
FID3  31,1.5 0 bottom
FID4  5,34.5 0 bottom
IC1  22,18 270 top
IC2  4.85,26 270 top
IC3  4.5,13 0 top
IC4  4.5,19 90 top
IC5  5.91,8.58 270 bottom
IC6  12.05,18.65 270 top
IN  12.5,2 180 top
L1  8.35,23.35 180 top
L2  20.2,7.25 270 top
L3  12.9,26.6 270 bottom
MMCX1  32.22,17.97 90 top
MODULE1  19.86,10.61 0 bottom
PWR  18.75,4.35 0 top
Q1  18.5,21 0 bottom
R1  11.05,12.1 180 top
R2  11.95,7.25 180 top
R3  14.55,7.25 180 top
R4  28.5,10.45 90 top
R5  28.85,24.35 180 top
R6  19.75,26.6 0 top
R7  14.65,26.6 0 top
R8  23.7,9.5 270 top
R9  22.7,9.5 270 top
R10  21.7,9.5 270 top
R11  19.59,24 180 bottom
R12  7,27 0 bottom
R13  6.6,7 270 top
R14  5.6,7 270 top
SWD  2.02,25.5 270 bottom
TEST1  1.1,23.25 0 top
TEST2  1.95,15.15 0 top
TEST3  10.05,14.8 0 top
TEST4  7.6,14.95 0 top
U1  3.5,8.1 90 top
U2  3.5,9.3 90 top
USB1  24.37,1.52 0 top

### Tracks (layer width: path | path; a pad name or v marks a point on that pad's centre or on a via)
!SRST  (via drill 0.3)
  Top 0.2: IC1.7 15.15,18.75 14.35,19.55 v14.35,20.1 | v9.75,24.95 9.75,25.7 9.35,26.1 9.35,27.75 8.1,29 v7.5,29
  Bottom 0.2: SWD.3 5.57,26.02 R12.2 C19.1 6.55,28.05 v7.5,29 | v9.75,24.95 9.75,24.9 9.15,24.3 9.15,23.4 10.15,22.4 10.15,20.55 10.65,20.05 14.45,20.05 v14.35,20.1
+3V3  (via drill 0.3)
  Top 0.2: 14.45,13.55 C5.1 14.5,12.55 10.65,8.7 10.5,8.8 | R2.4 11.18,8.12 10.5,8.8 | 10.5,8.8 7.1,8.8 6.6,8.3 6.6,8.2 | 6.6,8.2 R13.1 R14.1 | L1.1 9.15,25.65 8.8,26 8.8,26.95 v8.75,27 | 18.25,24.55 18.15,24.55 18.1,24.5 | v6.8,8.2 6.7,8.3 6.6,8.2 | 10.4,14.1 10.4,14.45 TEST3.1
  Top 0.25: 18.25,24.55 IC1.64 18.05,23.3 | IC1.19 19.25,10.75 18.95,10.45 C8.1 | IC1.13 15.25,15.75 14.45,14.95 | IC1.1 15.1,21.75 C10.1 | C9.1 14.45,14.95 | C11.1 29.2,22.2 28.75,21.75 IC1.48 27,21.75 | v14.8,15.1 14.45,14.95
  Top 0.3: 27,21.75 26.8,21.55 25.95,21.55 26,21.4 | 18.05,23.3 18.8,22.55 18.9,22.65 18.95,22.7 | 14.55,13.55 C5.1 | v19.45,10.9 19.25,10.75 | IC1.32 25.8,12.05 25.85,12
  Top 0.4: v9.45,14.1 10.4,14.1 12.25,15.95 C3.1
  Top 0.5: C9.1 14.45,13.55 | v15.25,13.65 15.15,13.55 14.55,13.55 | v15,22.9 14.65,22.55 C10.1 | IC6.5 | IC6.5 | IC6.5 13.2,19.75 v13.2,21.35 | v13.4,16.9 12.75,16.25 C3.1 12.3,16.5 12.3,18.4 13.35,19.45 IC6.5 | v27.25,8.9 27.25,9.13 26.93,9.45 C7.1 26.45,10 25.85,10.6 25.85,12 25.85,13.1 25.05,13.9 23.55,13.9 22.65,14.8 v19.4,14.8 | L1.1 9.85,23.35 v10,23.5 | v16.45,25.1 C4.1 16.85,26.15 C12.1 17.6,25.1 18.1,24.6 18.1,24.5 18.1,23.4
  Top 0.6: 18.9,22.65 19.25,22.65 20.05,21.85 23.45,21.85 23.9,21.4 26,21.4
  Bottom 0.2: IC5.8 IC5.7 2.46,9.21 | IC5.3 7.05,7.95 v6.8,8.2 | v8.75,27 R12.1
  Bottom 0.3: 20.25,14.8 19.95,14.9 20.3,14.9 21.8,13.4 21.8,13 21.75,13.3
  Bottom 0.4: v9.45,14.1 7.95,12.6 C6.1 8.03,11.83 6.68,10.48 5.99,10.48 5.5,10 4.5,10 4.01,10.48 IC5.8
  Bottom 0.5: MODULE1.5 27.64,9.61 v27.25,8.9 | v15.25,13.65 16.4,14.8 v19.4,14.8 20.25,14.8 | 21.75,13.3 21.75,12.35 20.3,10.9 v19.45,10.9 | v16.45,25.1 16.45,24.45 15,23 v15,22.9 14.75,22.9 v13.2,21.35 12.15,21.35 v10,23.5 | v13.4,16.9 14.8,15.5 v14.8,15.1
+5V  (via drill 0.3)
  Top 0.4: 13.8,0.8 13.85,0.75 | 15.55,0.75 15.4,0.8
  Top 0.5: 13.85,0.75 15.55,0.75
  Top 0.6: AUX1.2 32.5,25.02 | 32.5,25.02 32.58,25.02 33,24.6 33,22.2 35.2,20 35.2,16 33,13.8 33,12.6 | v32.5,25.5 32.5,25.02 | 33,12.6 34.4,11.2 34.4,9.6 33.4,8.6 33.4,7.9 30.5,5 v30.5,4 | AUX4.2 32.27,9.97 v32.6,10.3 | 33,12.6 v32.6,12.6 | v10,1.9 12.7,1.9 13.8,0.8 | 15.4,0.8 17.5,0.8 | 17.5,0.8 v18.2,0.8 | IN.NC2 17.5,0.8 | IN.2 10,5.55 v9.65,5.9
  Top 0.8: ENGINE5.2 ENGINE4.2 ENGINE3.2 ENGINE2.2 ENGINE1.2 | ENGINE7.2 ENGINE8.2
  Bottom 0.3: ENGINE8.2 5.08,32.08 4,31 1.5,31 0.65,31.85 0.65,33.7
  Bottom 0.6: L3.1 12.95,27.45 12.95,32.03 12.9,32.08 | AUX2.2 31.97,26.03 v32.5,25.5 33,26 33,28.5 29.42,32.08 ENGINE1.2 | v32.6,10.3 32.2,10.7 | 32.2,10.7 31.92,10.98 AUX3.2 | v32.6,12.6 32.6,11.1 32.2,10.7 | v18.2,0.8 28.1,0.8 30.5,3.2 v30.5,4 | v10,1.9 9.65,2.25 v9.65,5.9
  Bottom 0.8: ENGINE7.2 12.9,32.08 ENGINE6.2 ENGINE5.2
CAN_RX
  Top 0.2: IC1.33 27.6,14.25 27.6,11.35 27.73,11.22 R4.5
CAN_TX
  Top 0.2: IC1.34 27.1,14.75 26.85,14.55 26.85,14.1 27.2,13.75 27.2,11.2 27.7,10.7 R4.6
CONTROLL1_IN
  Top 0.2: IC1.16 16.25,13.7 11.7,9.15 R2.3
CONTROLL2_IN
  Top 0.2: IC1.36 26.75,15.75 26.35,16.15 23.1,16.15 22.7,15.75 22,15.75 21.9,15.85 18.95,15.85 12.72,9.62 12.55,9.45 | 12.55,9.45 12.2,9.1 R2.2 | 12.55,9.45 12.72,9.28 R2.1 R2.8
CONTROLL3_IN
  Top 0.2: IC1.35 26.65,15.25 26.15,15.75 23.3,15.75 22.9,15.35 21.8,15.35 21.7,15.45 19.1,15.45 13.78,10.12 R3.4
CONTROLL4_IN
  Top 0.2: IC1.27 23.25,12.9 21.95,14.2 18.45,14.2 14.3,10.05 R3.3
CONTROLL5_IN
  Top 0.2: IC1.26 22.75,12.85 21.75,13.85 18.7,13.85 14.8,9.95 R3.2
CONTROLL6_IN
  Top 0.2: R3.1 15.32,9.88 17.7,12.25 IC1.17
D_N  (via drill 0.3)
  Top 0.2: R9.1 22.7,10.65 v22.6,10.8 | v22.85,20.15 22.85,19.6 23.3,19.15 26.5,19.15 27.1,19.75 IC1.44
  Bottom 0.2: v22.85,20.15 22.85,19.6 20.7,17.45 20.7,16.5 23.25,13.95 23.25,11.65 22.6,11 v22.6,10.8
D_P  (via drill 0.3)
  Top 0.2: R8.1 v23.35,10.5 | IC1.45 26.95,20.25 26.3,19.6 25.3,19.6 25.2,19.7 25.2,20.1 25.1,20.2 24.8,20.2 24.7,20.1 24.7,19.7 24.6,19.6 24.3,19.6 24.2,19.7 24.2,20 24,20.2 23.7,20.2 23.6,20.1 v23.6,19.75
  Bottom 0.2: v23.6,19.75 21.1,17.3 21.1,16.7 23.65,14.15 23.65,11.4 23.35,11.1 v23.35,10.5
ENGINE1_PWM
  Top 0.2: R6.1 18.98,25.52 19.25,25.25 IC1.62
ENGINE2_PWM
  Top 0.2: R6.2 19.5,25.65 19.75,25.4 IC1.61
ENGINE3_PWM
  Top 0.2: R6.3 20,25.75 20.75,25 IC1.59
ENGINE4_PWM
  Top 0.2: R6.4 20.52,25.82 21.25,25.1 IC1.58
ENGINE5_PWM
  Top 0.2: IC1.40 23.5,17.75 22.05,19.2 21.8,19.2 19,22 18.7,22 15.43,25.27 R7.4
ENGINE6_PWM
  Top 0.2: R7.3 14.9,25.25 18.55,21.6 18.85,21.6 21.65,18.8 21.9,18.8 23.35,17.35 26.95,17.35 27.05,17.25 IC1.39
ENGINE7_PWM
  Top 0.2: R7.2 14.4,25.2 18.4,21.2 18.7,21.2 21.5,18.4 21.7,18.4 23.15,16.95 26.75,16.95 26.95,16.75 IC1.38
ENGINE8_PWM
  Top 0.2: R7.1 13.88,25.18 18.25,20.8 18.55,20.8 21.4,17.95 21.6,17.95 23,16.55 26.55,16.55 26.85,16.25 IC1.37
FLASH_SEL  (via drill 0.3)
  Top 0.2: IC1.24 21.75,12.9 21.4,13.25 v20.5,13.25
  Bottom 0.2: IC5.1 10.19,10.48 10.3,10.6 13.05,10.6 13.65,11.2 17.8,11.2 19.3,12.7 19.95,12.7 v20.5,13.25
GND  (via drill 0.3, 0.3 pad 0.45)
  Top 0.2: 6.55,12 6.9,12 6.9,11.4 7,11.3 C25.2 | C9.2 13.55,14.85 | C8.2 17.65,11.05 18.65,11.05 18.75,11.15 IC1.18 | 11.3,12.65 11.3,13 11.6,13.3
  Top 0.25: 6.3,12.25 6.55,12
  Top 0.28: 6.3,12.25 IC3.9
  Top 0.3: 0.75,31.75 0.65,31.85 0.65,33.7 | IC3.11 v6.95,13.25 | C13.2 3.95,10.25
  Top 0.35: 3.95,10.25 3.5,9.8
  Top 0.4: 13.55,14.85 13.95,15.25 | 12.9,13.4 12.9,14.1 13.25,14.45
  Top 0.5: IC6.2 11.6,18.65 | 11.15,18.65 11.35,18.65 11.75,19.05
  Bottom 0.2: 18.5,23.5 18.5,21.5 | 21.2,13.4 20.45,14.15 20.15,14.15 20,14
  other vias: 23,28.55 10.9,28.45 1.85,9.85 6.4,11.25 4.35,22.5 5.15,18 16.85,10.45 18.75,19.2 13.4,12.3 17.35,18.15 8.7,5.9 30.55,7.85 9.7,16.15 7.5,18.35 0.9,24.35 7.55,29.95 13.85,24.3 8.5,24.4 18.35,25.45 18.05,29.95 28.5,28.6 32.05,28 27.05,30.8 25.9,7.1 19.35,7.25 1.7,6.1 35,21.5 1,30.3 35,14.5 8.9,1.7 29.5,12 29.5,13.5 29.5,15 31,15 32.5,15 31,13.5 29.5,20 32,23 20.95,5.6 12.05,19.4 5.9,8.4 6.25,14.95 29.7,5.45 22.25,1.7 29.5,16.5 31.5,35 35,29.8 35,4.5 25.8,1.7 32.25,20.25 5.15,32.9 35,26.5 35,24.5 35,12 31.4,4.6 6,2.65 35,8.8 34.25,17.95 29,31.2 33.3,30.9 21.05,20.95 25.9,20.25 4.95,10.75
  pour Bottom (isolate 0.2): 4.1,31.9 4.1,35.4 31.9,35.4 31.9,31.9 35.4,31.9 35.4,4.1 31.9,4.1 31.9,0.6 4.1,0.6 4.1,4.1 0.6,4.1 0.6,31.9
  pour Top (isolate 0.2): 4.1,31.9 4.1,35.4 31.9,35.4 31.9,31.9 35.4,31.9 35.4,4.1 31.9,4.1 31.9,0.6 4.1,0.6 4.1,4.1 0.6,4.1 0.6,31.9
  cutout Top: 3,11.5 3,14.5 6,14.5 6,11.5
  cutout Bottom: 3,11.5 3,14.5 6,14.5 6,11.5
MAG_INT  (via drill 0.3)
  Top 0.2: IC1.2 14.9,21.25 14.35,21.8 13.95,21.8 13.45,22.3 11.25,22.3 10.9,21.95 10.9,21.6 9.55,20.25 7.75,20.25 v7,21 | IC3.15 4.25,15.95 v4.35,16.05
  Bottom 0.2: v4.35,16.05 4.35,17.5 3.5,18.35 2.3,18.35 2.15,18.5 2.15,20.1 2.4,20.35 6.35,20.35 v7,21
MPU_INT  (via drill 0.3)
  Top 0.2: IC4.12 7.15,20.25 7.55,19.85 9.75,19.85 10.65,20.75 v10.95,20.75 | v14.05,20.9 14.2,20.75 IC1.3
  Bottom 0.2: v10.95,20.75 13.95,20.75 v14.05,20.9
N$1
  Top 0.28: C25.1 7.55,12.45 6.8,12.45 6.5,12.75 IC3.10
N$2
  Top 0.2: R8.2 23.7,8.95 23.25,8.5 23.25,7.9 | 23.25,7.9 D2.6 | 23.25,7.9 23.25,6.25 24.37,5.12 USB1.3
N$3
  Top 0.2: ENGINE8.3 9.76,28.94 9.76,26.45 10.47,25.74 D7.1 10.67,25.37 11.05,25 12.25,25 13.4,26.15 13.4,27.3 13.65,27.55 13.85,27.55 13.85,27.02 R7.8
N$4
  Top 0.2: R7.7 14.4,27.75 14.1,28.05 13.45,28.05 13,27.6 13,26.85 12.6,26.45 11.97,26.45 | 11.97,26.45 10.45,26.45 10.15,26.75 10.15,28.65 11.04,29.54 ENGINE7.3 | D7.3 11.97,26.45
N$5
  Top 0.2: R7.6 14.9,28.88 ENGINE6.3 14.24,29.64 12.6,28 12.6,27.1 12.35,26.85 10.95,26.85 10.67,27.13 D7.6
N$6  (via drill 0.3)
  Top 0.2: R5.2 29.1,25.4 29.45,25.75 v29.85,25.75 | D6.4 v28.15,27.5
  Bottom 0.2: AUX2.3 30.27,25.03 29.85,25.45 v29.85,25.75 28.15,27.45 v28.15,27.5
N$7
  Top 0.2: R9.2 22.85,8.9 22.85,7.9 | 22.85,7.9 D2.1 | USB1.2 23.72,5.17 22.85,6.05 22.85,7.9
N$8
  Top 0.28: C26.1 9.2,11.15 8.55,10.5 6.15,10.5 5.25,11.4 IC3.8
N$9
  Top 0.2: R2.5 11.18,6.47 11.05,6.35 10.8,6.35 10.6,6.55 10.6,8.1 10.3,8.4 7.7,8.4 7.4,8.1 7.4,4.2 8.3,3.3 13.4,3.3 14.2,2.5 17.5,2.5 18.6,3.6 PWR.A
N$10
  Top 0.28: C26.2 9.2,13.3 8.6,13.9 6.65,13.9 6.5,13.75 IC3.12
N$11
  Top 0.2: R1.5 10.28,10.97 9.35,10.05 5,10.05 U2.A
N$12
  Top 0.2: R7.5 15.43,28.18 16.37,29.13 | 16.37,29.13 ENGINE5.3 | 16.37,29.13 16.37,29.25 14.82,30.8 13.75,30.8 13,30.05 13,29 12.02,28.02 11.97,27.97 D7.4
N$13
  Top 0.25: IC4.10 8,19.25
  Top 0.3: 8,19.25 C18.1
N$14
  Top 0.3: IC4.20 1.85,19.75 1.7,19.9 1.7,21.5 C24.1
N$15  (via drill 0.3)
  Top 0.2: R4.2 29.75,10.2 v29.85,10.1 30,9.95 30,8.5 D4.6
  Bottom 0.2: v29.85,10.1 29.97,9.98 AUX3.3
N$16
  Top 0.2: R6.6 20,27.35 20.4,27.75 21.15,27.75 21.45,27.45 21.45,26.55 21.6,26.4 22.5,26.4 | 22.5,26.4 23.85,26.4 24.2,26.75 24.2,29.34 ENGINE2.3 | D8.1 22.39,26.39 22.5,26.4
N$17
  Top 0.2: R6.5 20.52,27.27 20.6,27.35 20.95,27.35 21.05,27.25 21.05,25.95 22,25 23.5,25 23.69,25.19 D8.3 23.84,25.64 24.6,26.4 24.6,28.2 25.94,29.54 ENGINE1.3
N$18
  Top 0.2: R1.6 10.8,10.9 9.55,9.65 5.8,9.65 U1.A
N$19  (via drill 0.3)
  Top 0.2: IC1.60 20.25,23.15 20.65,22.75 v20.9,22.65
  Bottom 0.2: v20.9,22.65 20.9,23.4 20.3,24 R11.2
N$20
  Top 0.2: IC1.8 15.15,18.25 14.6,17.7 14.6,17.2 12.8,15.4 12.5,15.4 10.28,13.18 R1.4
N$21  (via drill 0.3)
  Top 0.4: v7.85,21.05 9.65,21.05 10.2,21.6 10.2,22.35 10.95,23.1 D1.2 | 19.7,3.2 v18.45,1.95
  Top 0.6: L2.2 19.7,5.95 19.7,3.2
  Bottom 0.4: 8.8,0.8 8.8,0.75 8.85,0.7 10.95,0.7 10.95,0.75 11,0.8 | 13.35,0.8 arc45 13.38,0.71 13.4,0.7 16.8,0.7 arc45 16.77,0.77 16.8,0.8
  Bottom 0.6: v7.85,21.05 7.85,21.55 6.8,22.55 6.05,22.55 5.1,21.6 1.95,21.6 1,20.65 1,17.8 1.65,17.15 2.5,17.15 2.9,16.7 2.9,16 0.85,13.95 0.85,5.75 1.4,5.2 3.65,5.2 5.1,3.75 5.1,2.3 6.6,0.8 8.8,0.8 | v18.45,1.95 18.15,1.65 17.9,1.65 16.95,0.8 16.8,0.8 | 11,0.8 13.35,0.8
N$22
  Top 0.2: D8.6 22.39,27.71 21.55,28.55 19.35,28.55 | 19.35,28.55 19.35,29.52 ENGINE4.3 | R6.8 18.98,28.18 19.35,28.55
N$23
  Top 0.2: IN.3 11.1,4.9 11.1,5.4 11,5.5 | D5.4 11,5.5 | R2.6 11.7,6.25 11,5.55 11,5.5
N$24
  Top 0.2: IC1.9 15.25,17.75 15,17.5 15,17 13,15 12.7,15 10.8,13.1 R1.3
N$25  (via drill 0.3)
  Top 0.2: IC1.6 17.15,19.25 18,18.4 v18.9,18.4
  Bottom 0.2: C20.2 19.85,22.8 20.4,22.25 20.4,21.05 Q1.1 19.57,19.07 v18.9,18.4
N$26  (via drill 0.3)
  Top 0.2: IC1.5 17.5,19.75 v17.95,19.3
  Bottom 0.2: C21.2 17.05,22.15 Q1.3 18.3,20.9 18.3,19.65 v17.95,19.3
N$27
  Top 0.2: R3.8 15.32,6.38 15.6,6.1 | 15.6,6.1 16,5.7 IN.8 | 15.6,6.1 16.1,6.6 D3.3
N$28
  Top 0.2: R3.5 13.78,6.28 13,5.5 IN.5 13,4.3 14.4,2.9 16.8,2.9 17.5,3.6 17.5,5.3 18.1,5.9 18.1,6.6 D3.4
N$29
  Top 0.2: R6.7 19.5,27.5 20.15,28.15 21.35,28.15 21.85,27.65 21.85,27 22.05,26.8 23.5,26.8 23.69,26.99 D8.4 23.69,28.71 22.86,29.54 ENGINE3.3
N$30
  Top 0.2: R4.4 29.88,11.22 30.62,11.97 AUX4.4 32.43,11.97 33.65,10.75 33.65,9.85 32.7,8.9 32.7,8.2 30.6,6.1 28.5,6.1 28,6.6 D4.3
N$31
  Top 0.2: R4.3 30.2,10.7 30.47,10.97 AUX4.3 32.78,10.97 33.2,10.55 33.2,10 32.3,9.1 32.3,8.4 30.5,6.6 D4.4
N$32  (via drill 0.3)
  Top 0.2: R4.1 29.32,9.68 29.45,9.55 29.45,9 v29.4,8.95 28.35,7.9 D4.1
  Bottom 0.2: v29.4,8.95 29.72,8.98 AUX3.4
N$33
  Top 0.2: R3.7 14.8,6 15,5.8 IN.7 15,4.3 15.6,3.7 16.4,3.7 16.7,4 16.7,5.7 17.3,6.3 17.3,7.55 16.95,7.9 D3.1
N$34
  Top 0.2: R3.6 14.3,6 14,5.7 IN.6 14,4.3 15,3.3 16.6,3.3 17.1,3.8 17.1,5.5 17.7,6.1 17.7,7.55 18.05,7.9 D3.6
N$35  (via drill 0.3)
  Top 0.2: v22.05,19.8 23.1,18.75 IC1.42 | R10.1 21.7,10.35 v21.85,10.5
  Bottom 0.2: v22.05,19.8 22.15,19.7 22.15,19.45 20.3,17.6 20.3,16.3 22.85,13.75 22.85,11.9 21.85,10.9 v21.85,10.5
N$38
  Top 0.15: 31.5,26 32.05,26 33.35,27.3 33.35,29.35 35.55,31.55 35.55,33.65
  Top 0.2: R5.3 28.6,25.6 | 28.6,25.6 29.35,26.35 30.26,26.35 30.59,26.02 AUX1.3 31.48,26.02 31.5,26 | D6.3 28.5,25.7 28.6,25.6
N$40  (via drill 0.3)
  Top 0.2: v30.45,23.1 30.1,23.45 30.1,25 29.98,25.12 29.62,25.12 R5.1 | D6.6 26.05,26.9 v26,26.85
  Bottom 0.2: v30.45,23.1 30.45,23.29 AUX2.4 31.16,24 30.1,24 29.2,24.9 29.2,25.8 28.15,26.85 v26,26.85
N$44
  Top 0.2: 25.25,10 C22.1
  Top 0.25: IC1.31 25.25,10
N$45  (via drill 0.3)
  Top 0.6: v12.9,24.65 12.9,23.45 D1.1
  Bottom 0.5: v12.9,24.65 L3.2
N$46
  Top 0.2: D5.3 8.1,4.1 8.5,3.7 11.4,3.7 12,4.3 IN.4 12,5.7 12.2,5.9 R2.7
N$50
  Top 0.2: 29.6,21.25 C23.1
  Top 0.25: IC1.47 29.6,21.25
N$51
  Top 0.15: 31.5,27 32.5,27 33,27.5 33,29.5 35.2,31.7 35.2,33.65
  Top 0.2: R5.4 28.07,25.12 28,25.2 27.75,25.2 27.55,25 26.5,25 26.05,25.45 D6.1 26.05,26.05 26.43,26.43 28.73,26.43 29.32,27.02 AUX1.4 31.21,27 31.5,27
N$56
  Bottom 0.6: MMCX1.S 28.5,17.97 28.14,17.61 MODULE1.1
N$67
  Bottom 0.2: MODULE1.6 27.39,7.61 26.5,8.5 26.5,10.7 27.41,11.61 MODULE1.4
N$68
  Bottom 0.2: MODULE1.7 26.55,6.92 26.55,7.85 26.1,8.3 26.1,10.9 26.55,11.35 26.55,12.25 27.86,13.56 MODULE1.3
RF_IRQ  (via drill 0.3)
  Top 0.2: IC1.4 18.55,20.25 21.05,17.75 21.05,17.35 20.75,17.05 v18.1,17.05
  Bottom 0.2: MODULE1.14 14.31,13.61 17.75,17.05 v18.1,17.05
RF_MISO  (via drill 0.3)
  Top 0.2: IC1.22 20.75,10.75 19.4,9.4 16.95,9.4 v16.6,9.05
  Bottom 0.2: 11.84,5.61 MODULE1.10 12.61,5.61 13.3,6.3 13.3,7.6 13.6,7.9 17.55,7.9 18.1,8.45 18.1,9.1 17.8,9.4 16.95,9.4 v16.6,9.05 16.55,9 13.4,9 13,8.6 10.85,8.6 10.4,8.6 9.79,9.21 IC5.2
RF_MOSI  (via drill 0.3)
  Top 0.2: v17.4,8.7 17.7,9 19.6,9 21.25,10.65 IC1.23
  Bottom 0.2: v17.4,8.7 17.1,8.4 13.45,8.4 13.1,8.05 12.3,8.05 MODULE1.11 10.11,7.61 9.8,7.3 6.3,7.3 5.67,6.67 IC5.5
RF_SCLK  (via drill 0.3)
  Top 0.2: IC1.21 20.25,10.85 19.2,9.8 v16.25,9.8
  Bottom 0.2: v16.25,9.8 16.15,9.8 15.96,9.61 MODULE1.12 11.62,9.85 6.35,9.85 4.45,7.95 IC5.6
RF_SEL  (via drill 0.3)
  Top 0.2: IC1.20 19.75,12.9 19.4,13.25 v19,13.25
  Bottom 0.2: MODULE1.13 17.36,11.61 v19,13.25
RXD3
  Top 0.2: IC1.52 24.25,24.75 24.5,25 25.95,25 26.85,24.1 27.45,23.5 27.95,23.5 28.07,23.62 R5.5
RXD4  (via drill 0.3)
  Top 0.2: R4.8 27.62,9.68 26.4,10.9 26.4,13.35 25.2,14.55 24.1,14.55 23.75,14.9 v23.75,15.15 | IC1.15 17.25,14.75 18.75,16.25 22.25,16.25 v22.35,16.35
  Bottom 0.2: v22.35,16.35 22.55,16.35 v23.75,15.15
RXD5
  Top 0.2: R5.8 29.62,23.27 28.6,22.25 26.7,22.25 26.45,22 24.2,22 23.25,22.95 IC1.54
SCL  (via drill 0.3)
  Top 0.2: IC2.8 6.85,24.45 5.6,23.2 2.4,23.2 1.2,22 1.2,18.5 1.45,18.25 | IC4.23 1.45,18.25 | 1.4,14.8 1.4,18.2 1.45,18.25 | 2.1,14.8 2.55,14.35 2.55,13.95 2.75,13.75 IC3.1 | 2.1,14.8 1.4,14.8 | IC1.29 24.25,11.15 v24.6,10.85 | v14.5,1.9 14.2,1.9 13.2,2.9 8.1,2.9 6.5,4.5 6.5,6.3 | R13.2 6.5,6.3 | 6.5,6.3 v6.25,5.95 | v4.7,6.1 3.5,6.1 1.2,8.4 1.2,14.6 1.4,14.8 | TEST2.1 2.1,14.8
  Bottom 0.2: v24.6,10.85 24.6,7.25 21.3,3.95 17.1,3.95 15.65,2.5 15.1,2.5 v14.5,1.9 | v6.25,5.95 6,6.1 v4.7,6.1
SDA  (via drill 0.3)
  Top 0.2: IC4.24 1.95,17.75 1.8,17.6 1.8,16.9 2.2,16.5 | IC2.7 5.4,23.95 5.1,23.65 2.25,23.65 1.3,22.7 | 1.3,22.7 0.8,22.2 v0.8,15.25 0.8,8.2 3.5,5.5 5.6,5.5 | 2.2,16.5 3.75,14.95 IC3.16 | v2,16.3 2.2,16.5 | IC1.30 v24.75,13.15 | v15.65,1.9 15.05,1.3 14.2,1.3 13,2.5 7.9,2.5 5.6,4.9 5.6,5.5 | 5.6,5.5 R14.2 | TEST1.1 1.1,22.9 1.3,22.7
  Bottom 0.2: v24.75,13.15 24.75,11.55 25.2,11.1 25.2,10.55 25,10.35 25,7.05 21.5,3.55 17.3,3.55 v15.65,1.9 | v2,16.3 1.85,16.3 v0.8,15.25
SWCLK  (via drill 0.3)
  Top 0.2: IC1.49 26.3,23.75 v26.4,23.65 | v25.3,30.6 16.1,30.6 15.3,31.4 15.3,32.55 14.7,33.15 13.8,33.15 13.2,32.55 13.2,31.3 12.5,30.6 4.25,30.6 1.85,28.2 1.85,25.15 v1.6,24.9
  Bottom 0.2: v26.4,23.65 24.3,25.75 24.3,27.7 25.45,28.85 25.45,30.45 v25.3,30.6 | v1.6,24.9 1.9,24.9 2.78,24.02 SWD.1
SWDIO  (via drill 0.3)
  Top 0.2: IC1.46 26.7,20.75 v26.6,20.85 | v26.2,30.8 25.8,31.2 25.05,31.2 24.85,31 16.3,31 15.7,31.6 15.7,32.75 14.9,33.55 13.6,33.55 12.8,32.75 12.8,31.55 12.25,31 4,31 1.2,28.2 v1.2,26.3
  Bottom 0.2: v26.6,20.85 27.1,21.35 27.1,24 26.7,24.4 26.5,24.4 24.7,26.2 24.7,27.4 25.9,28.6 25.9,30.5 v26.2,30.8 | v1.2,26.3 2.5,25 4.81,25 SWD.2
TXD3
  Top 0.2: R5.6 28.6,23.45 28.2,23.05 26.3,23.05 26.05,22.8 25,22.8 24.75,23.05 IC1.51
TXD4  (via drill 0.3)
  Top 0.2: R4.7 27.65,10.2 26.8,11.05 26.8,13.55 25.2,15.15 v24.6,15.15 | IC1.14 17.15,15.25 18.55,16.65 21.45,16.65 v21.75,16.95
  Bottom 0.2: v21.75,16.95 22.9,16.95 24.6,15.25 v24.6,15.15
TXD5
  Top 0.2: R5.7 29.1,23.35 28.4,22.65 26.5,22.65 26.25,22.4 24.4,22.4 23.75,23.05 IC1.53
V_RC
  Top 0.5: 9.7,17.9 9.7,19.05 10.25,19.6 IC6.1 11.05,19.6 11.95,20.5 11.95,21.15 D1.3 | 9.7,17.9 10,17.7 IC6.3 | C1.1 8.85,17.9 9.7,17.9
VCC
  Top 0.2: R10.2 21.7,9 21.15,9 L2.1 | D2.2 21.75,7.25
  Top 0.4: USB1.1 23.07,4.93 22.35,5.65 21.95,5.65 21.3,6.3 21.3,6.85 | D2.2 21.7,7.25 21.3,6.85 | L2.1 20.1,8.05 21.3,6.85
VCCA  (via drill 0.3)
  Top 0.2: IC3.4 2,12.25 | IC3.6 4.25,11.35 4,11.1 3,11.1 2.7,10.8
  Top 0.25: 5.75,18.75 IC4.13 5.75,22 5.95,22.2 C14.1 | 5.75,18.75 5.75,18.45 5.95,18.25 IC4.8 | IC4.9 5.75,18.75
  Top 0.28: v4.85,15.3 4.9,15.3 5.25,14.95 IC3.13
  Top 0.3: C14.1 7.55,22.5 | v6.45,21.7 6.75,22 C2.1 | 1.95,13.8 v1.95,13.85 | IC3.2 2,13.25 1.95,13.3 | 2,12.25 1.95,12
  Top 0.4: L1.2 7.8,23.55 7.8,25.73 6.72,26.8 IC2.1 | C13.1 2.7,10.8 1.95,11.55 1.95,12 1.95,13.3 v1.95,13.85
  Top 0.5: IC2.1 IC2.2 5.47,28.73 C15.1
  Top 0.6: C2.1 7.55,22.5 L1.2
  Bottom 0.28: v4.85,15.3 3.6,15.3
  Bottom 0.3: v1.95,13.85 3.6,15.3 3.6,17.5 3.25,17.85 2.05,17.85 1.7,18.2 1.7,20.35 2.2,20.85 5.6,20.85 v6.45,21.7

### Text on the board
tPlace: GND | OUT | V+ | SIG | 8 | 1
bPlace: By Emil Fresk | RST | emil.fresk@gmail.com | IO | Luleå, Sweden | CLK | KFly Rev 3.1
_tsilk: SDA | SCL | 3V3